# Altium project MotorLaserPCB.PrjPcb
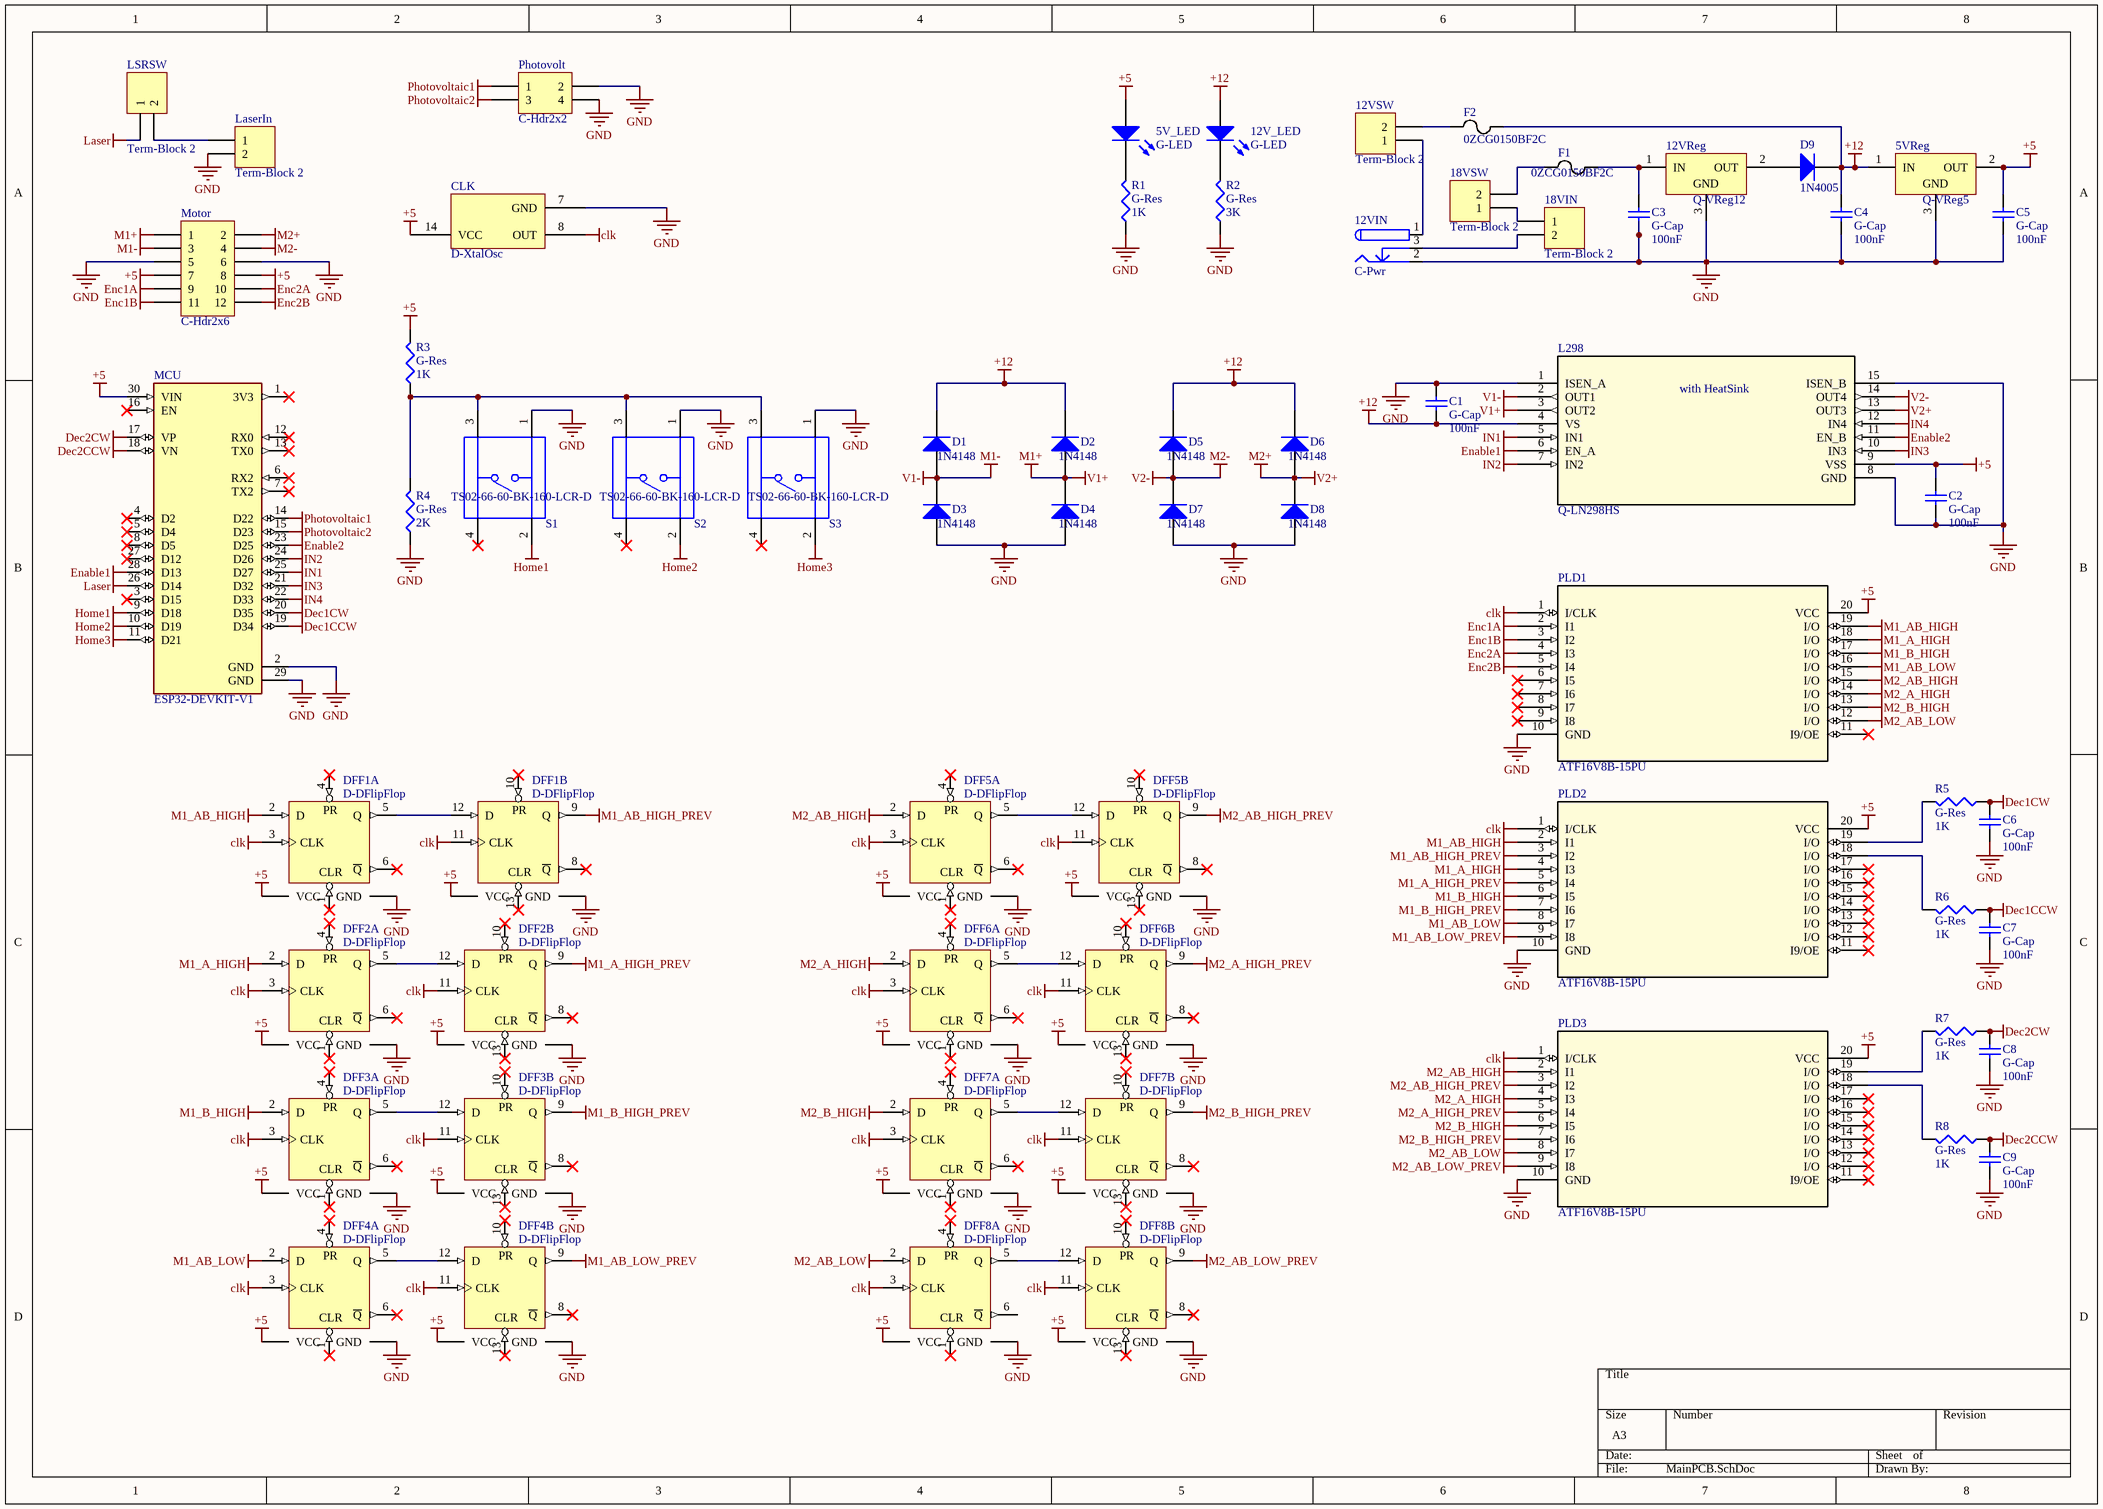
[diagram p0: MainPCB.SchDoc]
1 sheet, 57 parts. Net scope: global (net labels, ports and power ports of the same name join across sheets).
Board file: MainPCB.PcbDoc

## Sheet MainPCB.SchDoc
size A3; SheetNumber: 1; SheetTotal: 1; SPICEModelCachePRLASRHQ: <root> / <DocumentId>PRLASRHQ</DocumentId> / <CacheFrame Number="0"> / <Model Name="led2" Kind="MDL"> / <Text>*Typ RED,GREEN,YELLOW,AMBER GaAs LED: Vf=2.1V Vr=4V If=40mA trr=3uS / *LED Pinout: 1=A, 2=K / .MODEL LED2 D (IS=93.1P RS=42M N=4.61 BV=4 IBV=10U / + CJO=2.97P VJ=.75 M=.333 TT=4.32U)</Text> / </Model> / <Model Name="1n4148" Kind="CKT"> / <Text>* / ****************************************** / * / *1N4148 / * / *NXP Semiconductors / * / *High-speed diodes / * / * / * / * / * / * / * / * / * / * / * / *VRRM = 100V / *IFRM = 450 mA / *trr  = 4ns / * / *Package: SOD 27 / * / *Package Pin 1 : Cathode / *Package Pin 2 : Anode / * / * / * / * / *Simulator: PSPICE / * / ****************************************** / * / .SUBCKT 1N4148 1 2 / * / * The resistor R1 does not reflect / * a physical device. Instead it / * improves modeling in the reverse / * mode of operation. / * / R1 1 2 5.827E+9 / D1 1 2 1N4148 / * / .MODEL 1N4148 D / + IS = 4.352E-9 / + N = 1.906 / + BV = 110 / + IBV = 0.0001 / + RS = 0.6458 / + CJO = 7.048E-13 / + VJ = 0.869 / + M = 0.03 / + FC = 0.5 / + TT = 3.48E-9 / .ENDS</Text> / </Model> / <Model Name="1n4005" Kind="MDL"> / <Text>*1N4005 MCE 8-16-95 / *600V 1A Si GenPurpose Diode pkg:DIODE0.4 1,2 / .MODEL 1N4005 D(IS=2.55E-9 RS=0.042 N=1.75 TT=5.76E-6 CJO=1.85E-11 / + VJ=0.75 M=0.333 BV=600 IBV=5.92E-5 )</Text> / </Model> / <Model Name="sn74f74" Kind="MDL"> / <Text>*Texas Instruments / *SN74F74: Dual Positive-Edge-Triggered D-Type Flip-Flop with Clear and Preset / .MODEL SN74F74 xsimcode(file="{MODEL_PATH}FAST.SCB" func=f74 {mntymx})</Text> / </Model> / </CacheFrame> / </root>

### Parts
5V_LED  G-LED  [LED_LGE1.0]
5VReg  Q-VReg5  [TO220_XLGE1.2]
12V_LED  G-LED  [LED_LGE1.0]
12VIN  C-Pwr  [KLD_XLGE1.2]
12VReg  Q-VReg12  [TO220_XLGE1.2]
12VSW  Term-Block 2  [TERM-BLOCK-5.08MM-2POS]
18VIN  Term-Block 2  [TERM-BLOCK-5.08MM-2POS]
18VSW  Term-Block 2  [TERM-BLOCK-5.08MM-2POS]
C1  G-Cap  value 100nF  [Cap2.54mm_LGE1.0]
C2  G-Cap  value 100nF  [Cap2.54mm_LGE1.0]
C3  G-Cap  value 100nF  [Cap2.54mm_LGE1.0]
C4  G-Cap  value 100nF  [Cap2.54mm_LGE1.0]
C5  G-Cap  value 100nF  [Cap2.54mm_LGE1.0]
C6  G-Cap  value 100nF  [Cap2.54mm_LGE1.0]
C7  G-Cap  value 100nF  [Cap2.54mm_LGE1.0]
C8  G-Cap  value 100nF  [Cap2.54mm_LGE1.0]
C9  G-Cap  value 100nF  [Cap2.54mm_LGE1.0]
CLK  D-XtalOsc  [4Lead Osc_LGE1.0]
D1  1N4148  [DO-41_XLGE1.2]
D2  1N4148  [DO-41_XLGE1.2]
D3  1N4148  [DO-41_XLGE1.2]
D4  1N4148  [DO-41_XLGE1.2]
D5  1N4148  [DO-41_XLGE1.2]
D6  1N4148  [DO-41_XLGE1.2]
D7  1N4148  [DO-41_XLGE1.2]
D8  1N4148  [DO-41_XLGE1.2]
D9  1N4005  [DO-41_XLGE1.2]
DFF1  D-DFlipFlop  [DIP14_LGE1.0]  (parts A,B of 2)
DFF2  D-DFlipFlop  [DIP14_LGE1.0]  (parts A,B of 2)
DFF3  D-DFlipFlop  [DIP14_LGE1.0]  (parts A,B of 2)
DFF4  D-DFlipFlop  [DIP14_LGE1.0]  (parts A,B of 2)
DFF5  D-DFlipFlop  [DIP14_LGE1.0]  (parts A,B of 2)
DFF6  D-DFlipFlop  [DIP14_LGE1.0]  (parts A,B of 2)
DFF7  D-DFlipFlop  [DIP14_LGE1.0]  (parts A,B of 2)
DFF8  D-DFlipFlop  [DIP14_LGE1.0]  (parts A,B of 2)
F1  0ZCG0150BF2C  [0ZCG_BEL]
F2  0ZCG0150BF2C  [0ZCG_BEL]
L298  Q-LN298HS  [Multiwatt15_V_ELEC391HS]
LaserIn  Term-Block 2  [TERM-BLOCK-5.08MM-2POS]
LSRSW  Term-Block 2  [TERM-BLOCK-5.08MM-2POS]
MCU  ESP32-DEVKIT-V1  [MODULE_ESP32_DEVKIT_V1]
Motor  C-Hdr2x6  [HDR2X6_LGE1.0]
Photovolt  C-Hdr2x2  [HDR2X2_LGE1.0]
PLD1  ATF16V8B-15PU  [20P3_ATM]
PLD2  ATF16V8B-15PU  [20P3_ATM]
PLD3  ATF16V8B-15PU  [20P3_ATM]
R1  G-Res  value 1K  [Res10mm_LGE1.0]
R2  G-Res  value 3K  [Res10mm_LGE1.0]
R3  G-Res  value 1K  [Res10mm_LGE1.0]
R4  G-Res  value 2K  [Res10mm_LGE1.0]
R5  G-Res  value 1K  [Res10mm_LGE1.0]
R6  G-Res  value 1K  [Res10mm_LGE1.0]
R7  G-Res  value 1K  [Res10mm_LGE1.0]
R8  G-Res  value 1K  [Res10mm_LGE1.0]
S1  TS02-66-60-BK-160-LCR-D  [SW_TS02-66-60-BK-160-LCR-D]
S2  TS02-66-60-BK-160-LCR-D  [SW_TS02-66-60-BK-160-LCR-D]
S3  TS02-66-60-BK-160-LCR-D  [SW_TS02-66-60-BK-160-LCR-D]

### Nets
+5: 5V_LED.1(A) 5VReg.2(OUT) C2.1 C5.1 CLK.14(VCC) DFF1.14(VCC) DFF2.14(VCC) DFF3.14(VCC) DFF4.14(VCC) DFF5.14(VCC) DFF6.14(VCC) DFF7.14(VCC) DFF8.14(VCC) L298.9(VSS) MCU.30(VIN) Motor.7 Motor.8 PLD1.20(VCC) PLD2.20(VCC) PLD3.20(VCC) R3.2
+12: 5VReg.1(IN) 12V_LED.1(A) C1.2 C4.1 D1.2(K) D2.2(K) D5.2(K) D6.2(K) D9.2(K) F2.2 L298.4(VS)
clk: CLK.8(OUT) DFF1.3(CLK) DFF1.11(CLK) DFF2.3(CLK) DFF2.11(CLK) DFF3.3(CLK) DFF3.11(CLK) DFF4.3(CLK) DFF4.11(CLK) DFF5.3(CLK) DFF5.11(CLK) DFF6.3(CLK) DFF6.11(CLK) DFF7.3(CLK) DFF7.11(CLK) DFF8.3(CLK) DFF8.11(CLK) PLD1.1(I/CLK) PLD2.1(I/CLK) PLD3.1(I/CLK)
Dec1CCW: C7.1 MCU.19(D34) R6.1
Dec1CW: C6.1 MCU.20(D35) R5.1
Dec2CCW: C9.1 MCU.18(VN) R8.1
Dec2CW: C8.1 MCU.17(VP) R7.1
Enable1: L298.6(EN_A) MCU.28(D13)
Enable2: L298.11(EN_B) MCU.23(D25)
Enc1A: Motor.9 PLD1.2(I1)
Enc1B: Motor.11 PLD1.3(I2)
Enc2A: Motor.10 PLD1.4(I3)
Enc2B: Motor.12 PLD1.5(I4)
GND: 5VReg.3(GND) 12VIN.2 12VReg.3(GND) C1.1 C2.2 C3.2 C4.2 C5.2 C6.2 C7.2 C8.2 C9.2 CLK.7(GND) D3.1(A) D4.1(A) D7.1(A) D8.1(A) DFF1.7(GND) DFF2.7(GND) DFF3.7(GND) DFF4.7(GND) DFF5.7(GND) DFF6.7(GND) DFF7.7(GND) DFF8.7(GND) L298.1(ISEN_A) L298.8(GND) L298.15(ISEN_B) LaserIn.2 MCU.2(GND) MCU.29(GND) Motor.5 Motor.6 Photovolt.2 Photovolt.4 PLD1.10(GND) PLD2.10(GND) PLD3.10(GND) R1.1 R2.1 R4.1 S1.1 S2.1 S3.1
Home1: MCU.9(D18) S1.2
Home2: MCU.10(D19) S2.2
Home3: MCU.11(D21) S3.2
IN1: L298.5(IN1) MCU.25(D27)
IN2: L298.7(IN2) MCU.24(D26)
IN3: L298.10(IN3) MCU.21(D32)
IN4: L298.12(IN4) MCU.22(D33)
Laser: LSRSW.1 MCU.26(D14)
M1+: D2.1(A) D4.2(K) L298.3(OUT2) Motor.1  [also labelled V1+]
M1-: D1.1(A) D3.2(K) L298.2(OUT1) Motor.3  [also labelled V1-]
M1_A_HIGH: DFF2.2(D) PLD1.18(I/O) PLD2.4(I3)
M1_A_HIGH_PREV: DFF2.9(Q) PLD2.5(I4)
M1_AB_HIGH: DFF1.2(D) PLD1.19(I/O) PLD2.2(I1)
M1_AB_HIGH_PREV: DFF1.9(Q) PLD2.3(I2)
M1_AB_LOW: DFF4.2(D) PLD1.16(I/O) PLD2.8(I7)
M1_AB_LOW_PREV: DFF4.9(Q) PLD2.9(I8)
M1_B_HIGH: DFF3.2(D) PLD1.17(I/O) PLD2.6(I5)
M1_B_HIGH_PREV: DFF3.9(Q) PLD2.7(I6)
M2+: D6.1(A) D8.2(K) L298.13(OUT3) Motor.2  [also labelled V2+]
M2-: D5.1(A) D7.2(K) L298.14(OUT4) Motor.4  [also labelled V2-]
M2_A_HIGH: DFF6.2(D) PLD1.14(I/O) PLD3.4(I3)
M2_A_HIGH_PREV: DFF6.9(Q) PLD3.5(I4)
M2_AB_HIGH: DFF5.2(D) PLD1.15(I/O) PLD3.2(I1)
M2_AB_HIGH_PREV: DFF5.9(Q) PLD3.3(I2)
M2_AB_LOW: DFF8.2(D) PLD1.12(I/O) PLD3.8(I7)
M2_AB_LOW_PREV: DFF8.9(Q) PLD3.9(I8)
M2_B_HIGH: DFF7.2(D) PLD1.13(I/O) PLD3.6(I5)
M2_B_HIGH_PREV: DFF7.9(Q) PLD3.7(I6)
Photovoltaic1: MCU.14(D22) Photovolt.1
Photovoltaic2: MCU.15(D23) Photovolt.3
Net5V_LED_2: 5V_LED.2(K) R1.2
Net12V_LED_2: 12V_LED.2(K) R2.2
Net12VIN_1: 12VIN.1 12VSW.1
Net12VIN_3: 12VIN.3 18VIN.2
Net12VReg_1: 12VReg.1(IN) C3.1 F1.2
Net12VReg_2: 12VReg.2(OUT) D9.1(A)
Net12VSW_2: 12VSW.2 F2.1
Net18VIN_1: 18VIN.1 18VSW.1
Net18VSW_2: 18VSW.2 F1.1
NetDFF1_5: DFF1.5(Q) DFF1.12(D)
NetDFF2_5: DFF2.5(Q) DFF2.12(D)
NetDFF3_5: DFF3.5(Q) DFF3.12(D)
NetDFF4_5: DFF4.5(Q) DFF4.12(D)
NetDFF5_5: DFF5.5(Q) DFF5.12(D)
NetDFF6_5: DFF6.5(Q) DFF6.12(D)
NetDFF7_5: DFF7.5(Q) DFF7.12(D)
NetDFF8_5: DFF8.5(Q) DFF8.12(D)
NetLaserIn_1: LaserIn.1 LSRSW.2
NetPLD2_18: PLD2.18(I/O) R6.2
NetPLD2_19: PLD2.19(I/O) R5.2
NetPLD3_18: PLD3.18(I/O) R8.2
NetPLD3_19: PLD3.19(I/O) R7.2
NetR3_1: R3.1 R4.2 S1.3 S2.3 S3.3

Not connected (* = marked no-connect by the designer): CLK 1(NC); DFF1 1(CLR)* 4(PR)* 6(~{Q})* 8(~{Q})* 10(PR)* 13(CLR)*; DFF2 1(CLR)* 4(PR)* 6(~{Q})* 8(~{Q})* 10(PR)* 13(CLR)*; DFF3 1(CLR)* 4(PR)* 6(~{Q})* 8(~{Q})* 10(PR)* 13(CLR)*; DFF4 1(CLR)* 4(PR)* 6(~{Q})* 8(~{Q})* 10(PR)* 13(CLR)*; DFF5 1(CLR)* 4(PR)* 6(~{Q})* 8(~{Q})* 10(PR)* 13(CLR)*; DFF6 1(CLR)* 4(PR)* 6(~{Q})* 8(~{Q})* 10(PR)* 13(CLR)*; DFF7 1(CLR)* 4(PR)* 6(~{Q})* 8(~{Q})* 10(PR)* 13(CLR)*; DFF8 1(CLR)* 4(PR)* 6(~{Q}) 8(~{Q})* 10(PR)* 13(CLR)*; MCU 1(3V3)* 3(D15)* 4(D2)* 5(D4)* 6(RX2)* 7(TX2)* 8(D5)* 12(RX0)* 13(TX0)* 16(EN)* 27(D12)*; PLD1 6(I5)* 7(I6)* 8(I7)* 9(I8)* 11(I9/OE)*; PLD2 11(I9/OE)* 12(I/O)* 13(I/O)* 14(I/O)* 15(I/O)* 16(I/O)* 17(I/O)*; PLD3 11(I9/OE)* 12(I/O)* 13(I/O)* 14(I/O)* 15(I/O)* 16(I/O)* 17(I/O)*; S1 4*; S2 4*; S3 4*

### Notes on the sheet
- (in symbol Q-LN298HS) with HeatSink

### Library data of the parts
5V_LED 12V_LED = G-LED: Typical RED, GREEN, YELLOW, AMBER GaAs LED; Published: 8-Jun-2000; LatestRevisionDate: 17-Jul-2002; LatestRevisionNote: Re-released for DXP Platform.; PackageVersion: Feb-2002; PackageReference: 3.2X1.6X1.1; Publisher: Altium Limited
5VReg = Q-VReg5: voltage reg (5V); Published: 15-Apr-2002; DatasheetVersion: Oct-1999; PackageVersion: 1996; PackageReference: 29-04; Publisher: Altium Limited; PackageDescription: TO, Flat Index; 3 In-Line, Axial Leads; Body Dia. 4.8mm; Leads 0.48 x 0.51 mm (max); ComponentLink1Description: Manufacturer Link; ComponentLink1URL: http://www.onsemi.com/site/products/taxonomy/0,4438,503,00.html; ComponentLink2Description: Datasheet; ComponentLink2URL: http://www.onsemi.com/pub/Collateral/MC78L00A-D.PDF; ComponentLink3URL: https://www.fairchildsemi.com/datasheets/LM/LM7805.pdf; ComponentLink3Description: Datasheet (ELEC391)
12VIN = C-Pwr: Low Voltage Power Supply Connector; Published: 17-Dec-2003; DatasheetDocument: 09-May-2002; Publisher: Altium Limited; ComponentLink1Description: Manufacturer Link; ComponentLink1URL: http://domino.kycon.com/internet/Products.html; ComponentLink2URL: http://www.cui.com/product/resource/pj-102a.pdf; ComponentLink2Description: Datasheet (ELEC391)
12VReg = Q-VReg12: voltage reg (12V); ComponentLink1URL: https://www.fairchildsemi.com/datasheets/LM/LM7805.pdf; ComponentLink1Description: Datasheet (ELEC391)
12VSW 18VIN 18VSW LaserIn LSRSW = C-Block2: Terminal-Block 1x2; LatestRevisionDate: 17-Jul-2002; LatestRevisionNote: Re-released for DXP Platform.; Publisher: Altium Limited
C1-C9 = G-Cap: Capacitor (specify value); Published: 8-Jun-2000; LatestRevisionDate: 17-Jul-2002; LatestRevisionNote: Re-released for DXP Platform.; PackageReference: RAD-0.3; Publisher: Altium Limited
CLK = D-XtalOsc: Crystal Oscillator; Published: 8-Jun-2000; LatestRevisionDate: 17-Jul-2002; LatestRevisionNote: Re-released for DXP Platform.; PackageReference: R38; Publisher: Altium Limited; ComponentLink1URL: http://www.ecsxtal.com/store/pdf/ecs_100.pdf; ComponentLink1Description: Datasheet (ELEC391)
D1-D8 = T-DiodeRect: High-speed Diode; ComponentLink1URL: http://www.mccsemi.com/up_pdf/1N4148(DO-35).pdf; ComponentLink1Description: Datasheet (ELEC391)
D9 = T-Diode1N4005: Diode; Published: 8-Jun-2000; LatestRevisionDate: 17-Jul-2002; LatestRevisionNote: Re-released for DXP Platform.; DatasheetDocument: 1998; PackageDocument: Aug-1999; PackageReference: DO-41; Publisher: Altium Limited; Code_JEDEC: DO-204-AL; ComponentLink1Description: Manufacturer Link; ComponentLink1URL: http://www.fairchildsemi.com/; ComponentLink2Description: Pinout Specification; ComponentLink2URL: http://www.fairchildsemi.com/ds/1N%2F1N4001.pdf; ComponentLink3URL: http://www.mccsemi.com/up_pdf/1N4001-1N4007(DO-41).pdf; ComponentLink3Description: Datasheet (ELEC391)
DFF1-DFF8 = D-DFlipFlop: Dual D flip-flop; Published: 8-Jun-2000; LatestRevisionDate: 04-Mar-2005; LatestRevisionNote: Stylized 3D Model Added.; DatasheetVersion: Oct-1993; PackageVersion: Jun-1999; PackageReference: J014; Publisher: Altium Limited; PackageDescription: DIP; 14 Leads; Row Spacing 7.62 mm; Pitch 2.54 mm; ComponentLink1Description: Manufacturer Link; ComponentLink1URL: http://www.ti.com/; ComponentLink2Description: Datasheet; ComponentLink2URL: http://www-s.ti.com/sc/ds/sn74f74.pdf; ComponentLink3URL: http://www.ti.com/lit/ds/symlink/sn74hct74.pdf; ComponentLink3Description: Datasheet (ELEC391)
F1 F2 = 0ZCG0150BF2C: PTC RESET FUSE 24V 1.5A 1812; Mfr_Name: Belfuse
L298 = Q-LN298HS: LN298 - IC Bridge Driver Par 15Multiwatt; Manufacturer_Part_Number: L298N; Vendor: ST Microelectronics; Input Type: Non-Inverting; Number of Outputs: 4; Current - Output / Channel: 2A; Current - Peak Output: 3A; Voltage - Supply: 4.5 V ~ 46 V; C: Copyright (C) 2015 Accelerated Designs. All rights reserved; Quantity_Available: 5651; DataSheet: http://www.st.com/internet/com/TECHNICAL_RESOURCES/TECHNICAL_LITERATURE/DATASHEET/CD00000240.pdf; Type: Type; On-State Resistance: -; Operating Temperature: -25Â°C ~ 130Â°C; Mounting Type: Through Hole; Package / Case: Multiwatt-15 (Vertical, Bent and Staggered Leads); Supplier Device Package: 15-Multiwatt; Packaging: Tube; Copyright: Copyright (C) 2015 Accelerated Designs. All rights reserved; RefDes: RefDes; Value: Value; ComponentLink1URL: http://www.st.com/content/ccc/resource/technical/document/datasheet/82/cc/3f/39/0a/29/4d/f0/CD00000240.pdf/files/CD00000240.pdf/jcr:content/translations/en.CD00000240.pdf; ComponentLink1Description: Datasheet (ELEC391)
MCU = ESP32-DEVKIT-V1: Dual core, Wi-Fi: 2.4 GHz up to 150 Mbits/s,BLE (Bluetooth Low Energy) and legacy Bluetooth, 32 bits, Up to 240 MHz; MF: Do it; Price: None; Availability: Not in stock; Package: None; MP: ESP32-DEVKIT-V1; Value: *; SnapEDA_Link: https://www.snapeda.com/parts/ESP32-DEVKIT-V1/Do+it/view-part/?ref=snap; Check_prices: https://www.snapeda.com/parts/ESP32-DEVKIT-V1/Do+it/view-part/?ref=eda
Motor = C-Hdr2x6: Header, 6-Pin, Dual row; LatestRevisionDate: 17-Jul-2002; LatestRevisionNote: Re-released for DXP Platform.; Publisher: Altium Limited
Photovolt = C-Hdr2x2: Header, 2-Pin, Dual row; LatestRevisionDate: 17-Jul-2002; LatestRevisionNote: Re-released for DXP Platform.; Publisher: Altium Limited
PLD1-PLD3 = ATF16V8B-15PU: No Description Available; Mfr_Name: Microchip; RefDes: RefDes; Type: Type
R1-R8 = G-Res: Resistor (specify value); Published: 8-Jun-2000; LatestRevisionDate: 29-May-2009; LatestRevisionNote: IPC-7351 Footprint Added.; PackageReference: J1-0603; Publisher: Altium Limited; PackageDescription: Chip Resistor
S1-S3 = TS02-66-60-BK-160-LCR-D: 6 x 6 mm, 6 mm Actuator Height, 160 gf, Black, Long Crimped, Through Hole, SPST, Tactile Switch; MF: CUI Devices; CUI_purchase_URL: https://www.cuidevices.com/product/switches/tactile-switches/ts02-series?utm_source=snapeda.com&utm_medium=referral&utm_campaign=snapedaBOM; Check_prices: https://www.snapeda.com/parts/TS02-66-60-BK-160-LCR-D/CUI+Devices/view-part/?ref=eda; Purchase-URL: https://pricing.snapeda.com/search/part/TS02-66-60-BK-160-LCR-D/?ref=eda; Price: None; Availability: In Stock; SnapEDA_Link: https://www.snapeda.com/parts/TS02-66-60-BK-160-LCR-D/CUI+Devices/view-part/?ref=snap; Package: None; MP: TS02-66-60-BK-160-LCR-D; Value: *